# Altium schematic sheet Linear_Power.SchDoc
size A; SheetNumber: 1; SheetTotal: 2
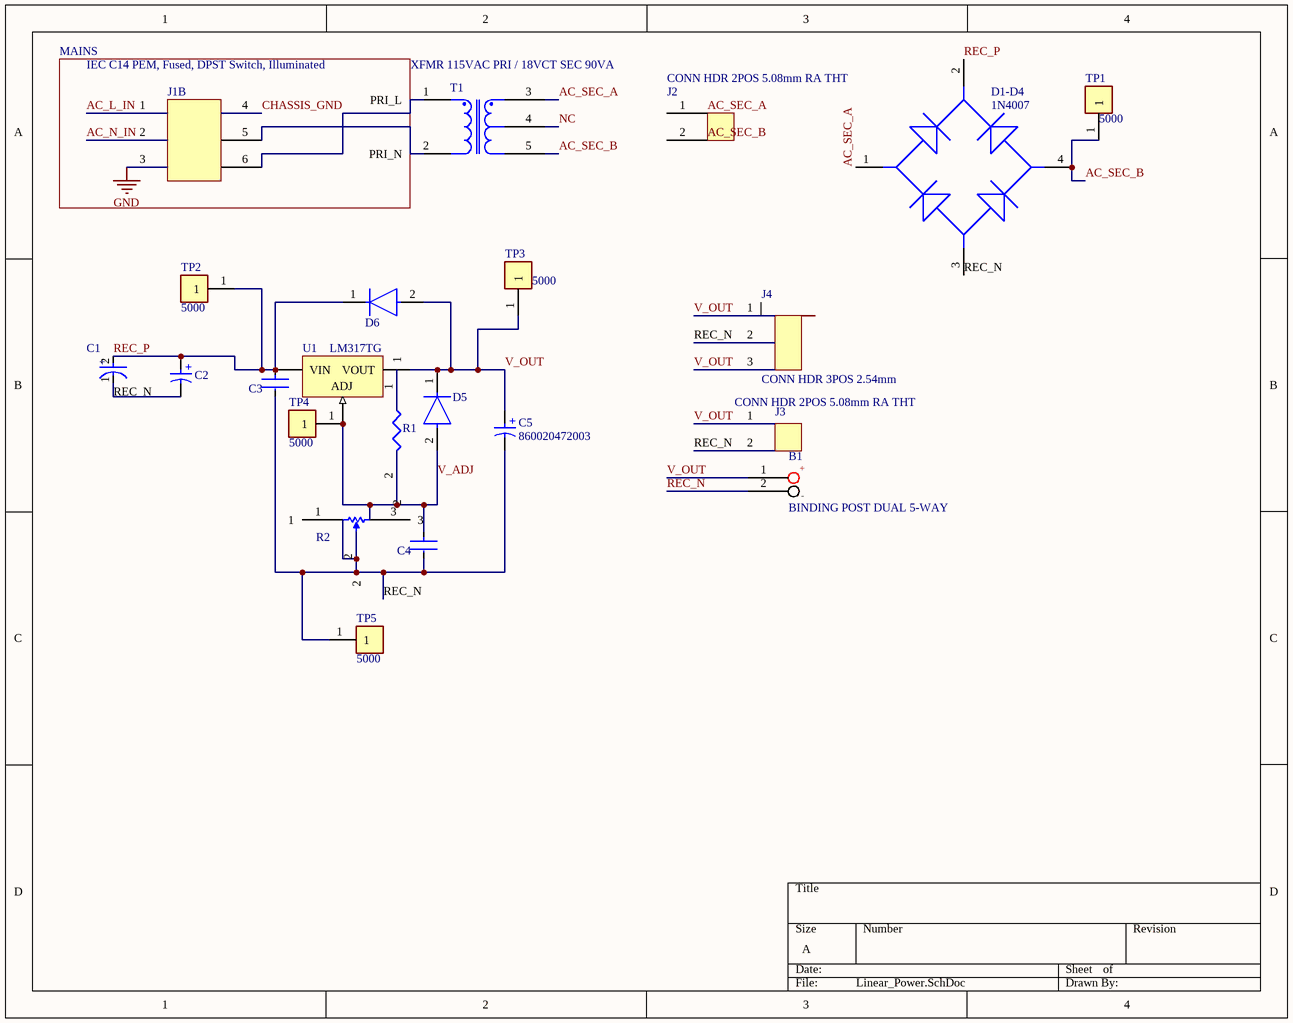
[diagram p0: Linear_Power.SchDoc]

## Parts
B1  BINDING POST DUAL 5-WAY
C1  UPW1V222MHD6  [FP-227AVG035MFBJ-MFG]  (value not drawn)
C2  UPJ1V101MPD  [WCAP-ATLI_D5H11]  (value not drawn)
C3  C410C104Z5U5TA7200  [FP-RHE0K1-MFG]  (value not drawn)
C4  C410C104Z5U5TA7200  [FP-RHE0K1-MFG]  (value not drawn)
C5  860020472003  [WCAP-ATG5_D5H11]
D1-D4  1N4007  [FP-KBJ-MFG]
D5  1N4007  [FP-1N4007-MFG]  (value not drawn)
D6  1N4007  [FP-1N4007-MFG]  (value not drawn)
J1  IEC C14 PEM, Fused, DPST Switch, Illuminated  (part B of 2)
J2  CONN HDR 2POS 5.08mm RA THT  [OSTOQ025451]
J3  CONN HDR 2POS 5.08mm RA THT  [OSTOQ025451]
J4  CONN HDR 3POS 2.54mm  [Connector, header vertical 3-pos 2.54mm]
R1  240 Ohm,1/4W,1%  [pp]  (value not drawn)
R2  Potentiometer linear 4.7 kOhm±20 %,  [PC16SH07IP04-472A2020--TA]  (value not drawn)
T1  XFMR 115VAC PRI / 18VCT SEC 90VA
TP1  5000  [FP-5000-MFG]
TP2  5000  [FP-5000-MFG]
TP3  5000  [FP-5000-MFG]
TP4  5000  [FP-5000-MFG]
TP5  5000  [FP-5000-MFG]
U1  LM317TG  [ONSC-TO-220-3-221AB-01]

## Blocks framed on the sheet
MAINS: J1

## Nets
GND: J1.3(L_IN)
AC_L_IN: J1.1(GND_IN)
AC_N_IN: J1.2(N_IN)
AC_SEC_A: D1-D4.1(+) J2.1(AC_SEC_1)
AC_SEC_B: D1-D4.4(-) J2.2(AC_SEC_2) TP1.1
CHASSIS_GND: J1.4(GND_OUT)
REC_N: C1.1(C) C2.2(N) C3.2 C4.2 C5.2(N) D1-D4.3(2_~) J3.2(AC_SEC_2) J4.2 R2.1 R2.2 TP5.1
REC_P: C1.2(A) C2.1(P) C3.1 D1-D4.2(1_~) D6.1(C) TP2.1 U1.3(VIN)
V_ADJ: C4.1 D5.2(A) R1.2 R2.3 TP4.1 U1.1(ADJ)
V_OUT: C5.1(P) D5.1(C) D6.2(A) J3.1(AC_SEC_1) J4.1 J4.3 TP3.1 U1.2(VOUT)

Not connected (* = marked no-connect by the designer): B1 1(V_OUT_POS) 2(V_OUT_NEG); J1 5(N_OUT) 6(L_OUT); R1 1; T1 1(PRI_L) 2(PRI_N) 3(SEC_1) 4(SEC_CT) 5(SEC_2)

## Notes on the sheet
- (in symbol BU-P6883) +; -
- (in symbol CMP-00087-58146014-1) +
- (in symbol CMP-03913-53914185-1) +
- (in symbol CMP-03913-54007346-2) +

## Library data of the parts
B1 = BU-P6883
C1 = CMP-00087-58146014-1: 227AVG035MFBJ AVG Series 35 V 220 uF 8 x 12 mm LS=3.5 mm Radial Aluminum Polymer Capacitor; Ripple Current: 2.95A; Life (Hours): 1500hours; Tolerance: 20%; Capacitance: 220µF; Voltage Rating (DC): 35V; Leakage Current: 1.54mA; ESR (Equivalent Series Resistance): 26mΩ; Dissipation Factor: 12%; Case/Package: Radial; Height: 13.5mm; NexarPartId: 58146014; Max Operating Temperature: 125°C; Min Operating Temperature: -55°C; RoHS: Non-Compliant; Voltage Rating: 35V
C2 = CMP-03913-54007346-2: WCAP-ATLI Aluminum Electrolytic Capacitors; Manufacturer Lifecycle Status: ACTIVE; YEOL: 1 = Estimated lifetime > 10 years; Voltage Rating: 63V; Life (Hours): 2000hours; Capacitance: 10µF; Impedance: 950mΩ; Material: Aluminium; Leakage Current: 6.3µA; Pitch: 2mm; Ripple Current: 135mA; Tolerance: 20%; Polarity: Polar; RoHS: Compliant; Lead Pitch: 2.0066mm; Lifecycle Status: Production; Case/Package: Radial; Length: 11mm; Height: 11mm; Max Operating Temperature: 105°C; Height - Seated (Max): 12.4968mm; Mount: Through Hole; Voltage Rating (DC): 63V; Min Operating Temperature: -55°C; Packaging: Tape & Box (TB); Diameter: 5mm; REACH SVHC: Unknown
C3 C4 = CMP-06035-006182-1: Multilayer Ceramic Capacitor, 0.1 uF, 50 V, -20%, +80%, Z5U, Axial Leaded
C5 = CMP-03913-53914185-1: 860020472003 WCAP-ATG5 Aluminum Electrolytic Capacitors; Leakage Current: 3µA; Tolerance: 20%; Ripple Current: 38mA; Polarity: Polar; Voltage Rating: 25V; Pitch: 2mm; Capacitance: 10µF; Life (Hours): 2000hours; NexarPartId: 53914185; Min Operating Temperature: -40°C; Length: 11mm; Lead Pitch: 2.0066mm; Mount: Through Hole; Case/Package: Radial; RoHS: Compliant; Max Operating Temperature: 105°C; Diameter: 5mm; Packaging: Tape & Box (TB); Height - Seated (Max): 12.4968mm
D1-D4 = CMP-12791-000017-1: BRIDGE RECT 1PHASE 800V 6A KBJ; Manufacturer: Diodes; Manufacturer Part Number: KBJ608G; Max Junction Temp: +150°C; Max Surge Forward Current: 170A; Peak Reverse Current: 5uA; Standoff Height: 3.3mm; Value: 80pF; Forward Current: 3A; Mouser Description: Bridge Rectifiers 6.0A 800V; Digikey Description: BRIDGE RECT 1PHASE 800V 6A KBJ; Max Repetitive Reverse Voltage: 800V; ComponentLink2Description: Datasheet; Device Class L1: Discrete Semiconductors; Octopart: https://octopart.com/kbj608g-diodes+inc.-13390835; Temperature Range Low: -65°C; Temperature: -65°C to +150°C; Automotive: No; ComponentLink2URL: https://www.diodes.com/assets/Datasheets/ds21207.pdf; RoHS: TRUE; Category: Diode; Lead Free: Yes; Footprint Url: https://www.diodes.com/assets/Package-Files/KBJ.pdf; Reverse Voltage: 800V; Device Class L2: Diodes; Package: KBJ; Device Class L3: Rectifier Diodes; Capacitance: 80pF; Height: 19mm; Temperature Range High: +150°C
D5 D6 = CMP-123542-000001-1: Rectifier diode 1000 V 1 A DO-41, ,; Manufacturer: Diotec; Max Surge Forward Current: 27A; Forward Current: 1A; Max Junction Temp: +175°C; Reverse Voltage: 1000V; Value: 15pF; Peak Reverse Current: 5uA; Category: Diode; Temperature Range Low: -50°C; Automotive: No; Temperature: -50°C to +175°C; Lead Free: Yes; ComponentLink2Description: Datasheet; Max Repetitive Reverse Voltage: 1000V; ComponentLink2URL: https://datasheet.octopart.com/1N4007-Diotec-datasheet-62346875.pdf; Manufacturer Part Number: 1N4007; Device Class L3: Rectifier Diodes; Height: 2.8mm; Octopart: https://octopart.com/1n4007-diotec-4040411; Package: 1N4007; Temperature Range High: +175°C; Device Class L1: Discrete Semiconductors; Device Class L2: Diodes; RoHS: TRUE; Capacitance: 15pF; Ipc Land Pattern Name: DIOAD888W100L520D280
J1 = 719W-UEL3BR51: Mains Power Connector; Manufacturer: Qualtek; Supplier: DigiKey; Supplier Part Number: 189-719W-UEL3BR51-ND; Manufacturer Part Number: 719W-UEL3BR51; RoHS: Compliant; Category: Power Connectors; Stock: 363; Pricing: 1=7.66, 10=6.506, 30=6.02, 50=5.8068, 100=5.5296, 250=5.18348, 500=4.93622, 1000=4.70083 (USD); Export Control Classification Number (ECCN) Code: EAR99; Harmonized Tariff Schedule (HTS) Code: 8536.69.40.30; Introduction Date: 2024-04-05; Lifecycle Status: Production
J2 J3 = OSTOQ025451: 2-position, 5.08mm pitch, shrouded, right-angle, through-hole header
J4 = PRPC003SAAN-RC: Header, 3-position, 0.1in pitch, straight, TH
R1 = RNMF14FTC240R: Through Hole Resistor 240 Ohm,1/4W,1%, Axial
R2 = PC16SH07IP04-472A2020--TA: Potentiometer linear 4.7 kOhm±20 %, PC16SH07IP04-472A2020--TA, Piher; Value: 4.7kΩ; Tolerance: 20%; Supplier: Newark; Supplier Part Number: PC16SH-07IP04-472A2020-TA; Manufacturer: Piher; Manufacturer Part Number: PC16SH07IP04-472A2020--TA; RoHS: Compliant; Category: Variable Resistors and Potentiometers; Stock: 2313; Pricing: 1=2.71, 10=2.37, 25=2.26, 50=2.13, 100=1.96, 250=1.91, 500=1.8, 1000=1.6 (USD); Composition: Carbon; Mounting Technology: Through Hole
T1 = 166P18: Power transformer, 115VAC primary, 18V center-tapped secondary, 5A, 90VA, chassis mount, wire leads; Manufacturer: Hammond; Approvals: CSA, UL; Frequency: 60Hz; Isolation Voltage: 2000Vrms; Max Power Dissipation: 90W; Nominal Supply Voltage: 115V; Primary Winding(s): Single; Supplier: Newark; Supplier Part Number: 166P18; Manufacturer Part Number: 166P18; RoHS: Compliant; Category: Transformers; Stock: 34; Pricing: 1=44.28, 5=42.04, 10=39.81, 25=37.85, 50=36.92, 100=33.62, 250=32.97 (USD); Current Rating: 5A; Height: 66.802mm; Height - Seated (Max): 66.8mm; Length: 102.362mm; Lifecycle Status: Production; Max Operating Temperature: 130°C; Max Output current: 5A; Min Operating Temperature: 0°C; Mounting Technology: Chassis Mount; Output Current: 5A; Output Voltage: 18V; Packaging: Bulk; Power Rating: 90W; REACH SVHC: Yes; Schedule B: 8504314035; Secondary Winding(s): Single; Termination: Wire Leads; Width: 63.5mm; ComponentLink1URL: https://datasheet.octopart.com:443/166P18-Hammond-datasheet-179918239.pdf?src-supplier=IHS; ComponentLink1Description: https://datasheet.octopart.com:443/166P18-Hammond-datasheet-179918239.pdf?src-supplier=IHS; ComponentLink2URL: https://datasheet.octopart.com:443/166P18-Hammond-datasheet-8450255.pdf?src-supplier=Master+Electronics; ComponentLink2Description: https://datasheet.octopart.com:443/166P18-Hammond-datasheet-8450255.pdf?src-supplier=Master+Electronics; ComponentLink3URL: https://datasheet.octopart.com:443/166P18-Hammond-datasheet-78727889.pdf?src-supplier=Newark; ComponentLink3Description: https://datasheet.octopart.com:443/166P18-Hammond-datasheet-78727889.pdf?src-supplier=Newark; ComponentLink4URL: https://datasheet.octopart.com:443/166P18-Hammond-datasheet-1636.pdf?src-supplier=DigiKey; ComponentLink4Description: https://datasheet.octopart.com:443/166P18-Hammond-datasheet-1636.pdf?src-supplier=DigiKey; ComponentLink5URL: https://datasheet.octopart.com:443/166P18-Hammond-datasheet-154734928.pdf?src-supplier=Electro+Sonic; ComponentLink5Description: https://datasheet.octopart.com:443/166P18-Hammond-datasheet-154734928.pdf?src-supplier=Electro+Sonic; ComponentLink6URL: https://datasheet.octopart.com:443/166P18-Hammond-datasheet-9571880.pdf?src-supplier=RS+(Formerly+Allied+Electronics); ComponentLink6Description: https://datasheet.octopart.com:443/166P18-Hammond-datasheet-9571880.pdf?src-supplier=RS+(Formerly+Allied+Electronics); ComponentLink7URL: https://datasheet.octopart.com:443/166P18-Hammond-datasheet-16756.pdf?src-supplier=RS+(Formerly+Allied+Electronics); ComponentLink7Description: https://datasheet.octopart.com:443/166P18-Hammond-datasheet-16756.pdf?src-supplier=RS+(Formerly+Allied+Electronics); ComponentLink8URL: https://datasheet.octopart.com:443/166P18-Hammond-datasheet-17018915.pdf?src-supplier=Factory+Futures; ComponentLink8Description: https://datasheet.octopart.com:443/166P18-Hammond-datasheet-17018915.pdf?src-supplier=Factory+Futures; ComponentLink9URL: http://sigma.octopart.com:80/conflict_mineral_statement/Hammond-company-48.pdf?src-supplier=Compliance+Statements; ComponentLink9Description: http://sigma.octopart.com:80/conflict_mineral_statement/Hammond-company-48.pdf?src-supplier=Compliance+Statements
TP1-TP5 = CMP-19636-000027-1: PC TEST POINT MINIATURE RED; Outside Diameter: 2.54mm; Body Material: Bronze; Number of Contacts: 1; Insulation: Insulated; Inside Diameter: 1.27mm; Hole Diameter: 1.6mm; Plating: Silver; Length: 7.62mm; Package Quantity: 100; Number of Ports: 1; Contact Material: Bronze; Orientation: Straight; RoHS Compliant: Yes; Housing Color: Red; Height: 0.3inch; Series: THM; Lead Free: Lead Free; Color: Red; Contact Plating: Tin; Mount: PCB; Packaging: Bulk; REACH SVHC: No SVHC; Flammability Rating: UL94 V-0; Material: Nylon
U1 = CMP-1679-00013-1: 1.5 A Adjustable Output, Positive Voltage Regulator, 0 to 125 degC, 3-Pin TO-220 (221AB-01), Pb-Free, Rail; Current Rating: 500 mA; Height: 2.95 mm; Package Quantity: 500; Radiation Hardening: No; PackageDescription: 3-Pin Flange Mount, Vertical Straight Lead, Body 9.97 x 4.445 mm, Pitch 2.54 mm; DatasheetVersion: Rev. 14, 01/2016; Contact Plating: Gold; Contact Material: Copper; REACH SVHC: Unknown; ComponentLink2URL: http://www.onsemi.com/pub_link/Collateral/LM317-D.PDF; Length: 27.4 mm; Min Operating Temperature: -25degC; RoHSCompliant: True; Contact Finish: Gold; Lead Pitch: 2.5 mm; PackageVersion: Rev. A, 11/2010; PackageReference: TO-220-3-221AB-01; Mount: Surface Mount; ComponentLink1URL: http://www.onsemi.com/; Pins: 9; ComponentLink1Description: Manufacturer URL; Packaging: Tape and Reel; Max Operating Temperature: 85degC; ComponentLink2Description: Datasheet